# EAGLE design camera_module_dev (EAGLE 6.5.0)
AUTHOR: Austin Buchan; REVISION: 0.1
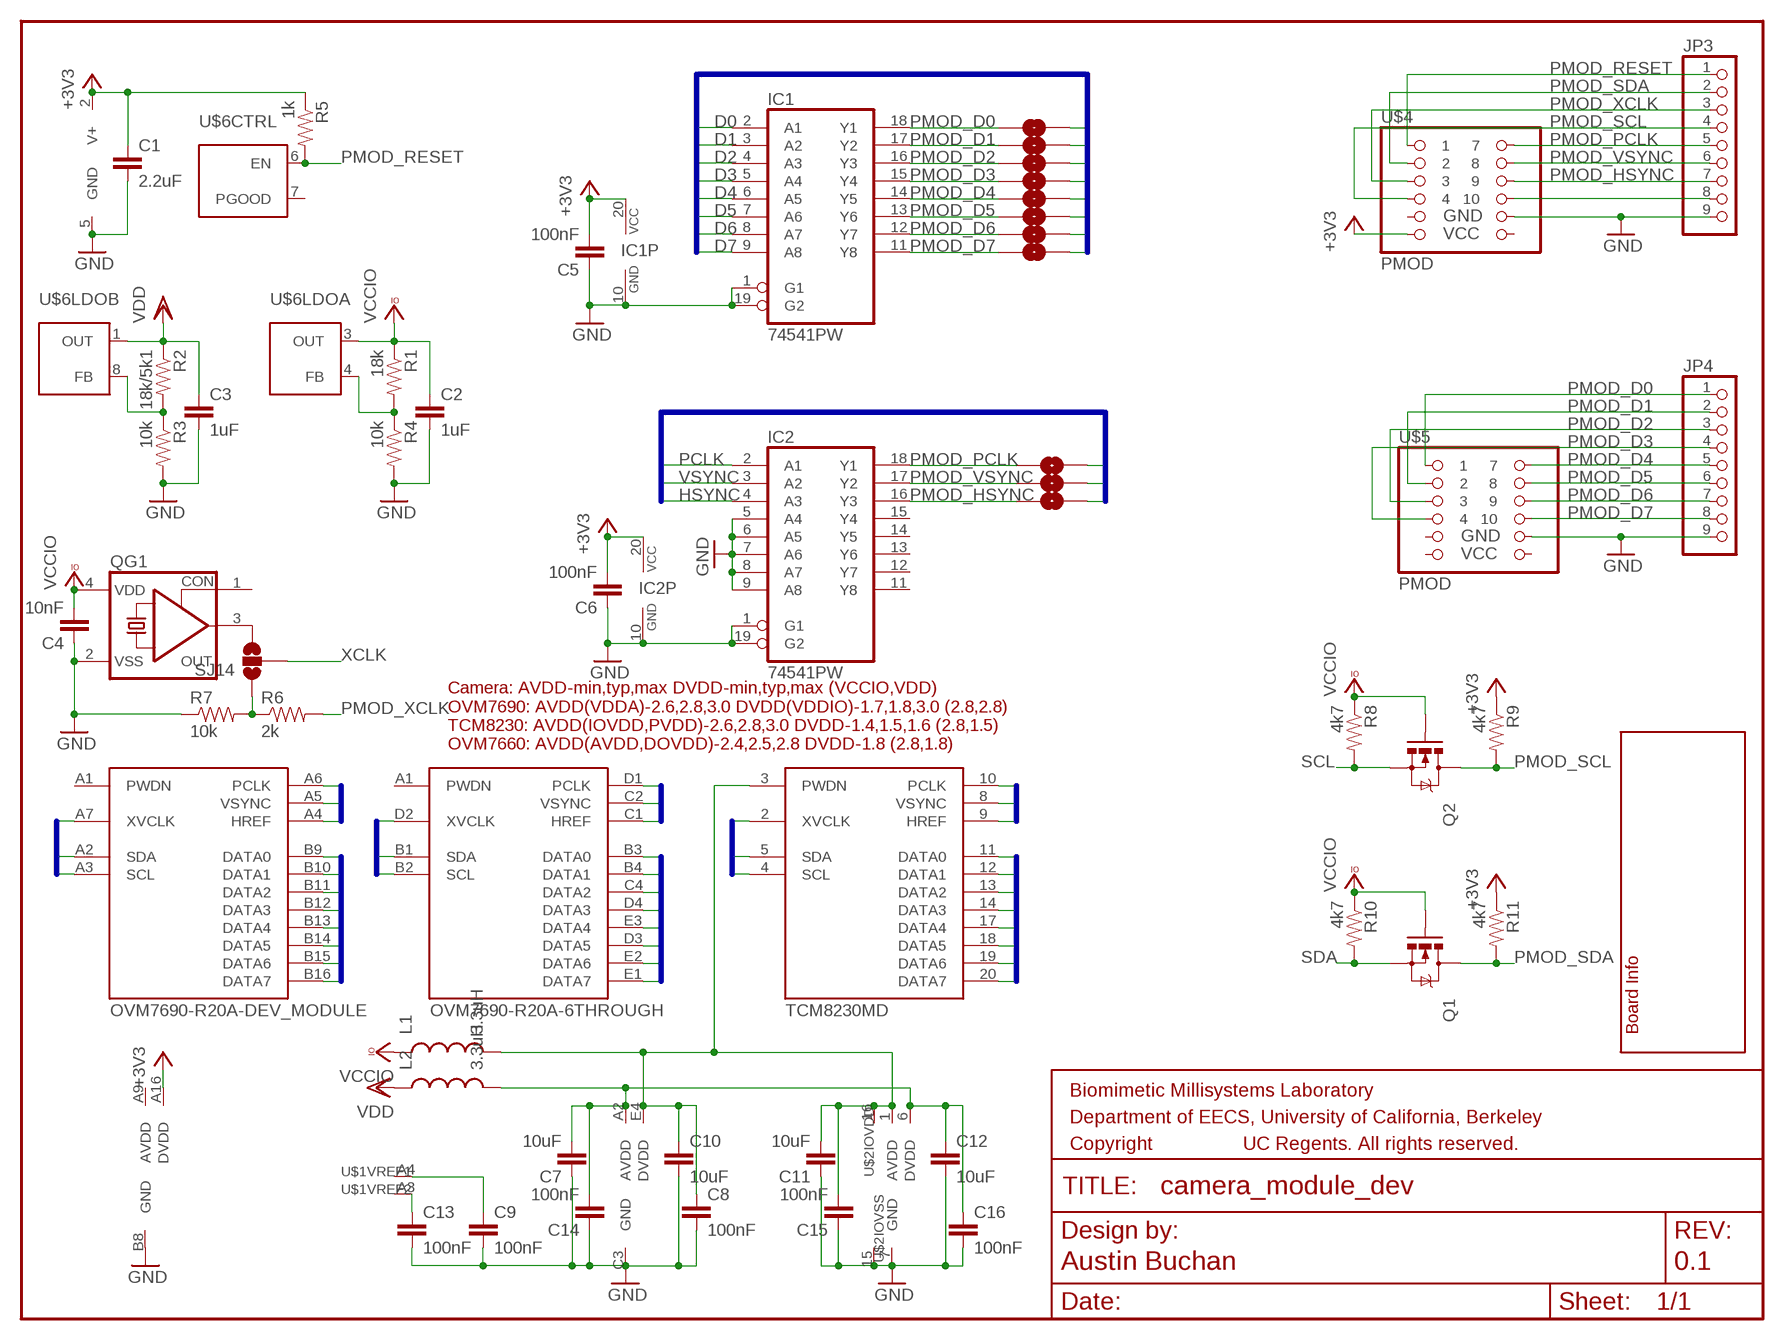
[diagram p0: schematic, sheet 1]

## Parts
C1  2.2uF  CAP0402-CAP  [0402-CAP]
C2  1uF  CAP0402-CAP  [0402-CAP]
C3  1uF  CAP0402-CAP  [0402-CAP]
C4  10nF  CAP0402-CAP  [0402-CAP]
C5  100nF  CAP0402-CAP  [0402-CAP]
C6  100nF  CAP0402-CAP  [0402-CAP]
C7  10uF  CAP0603-CAP  [0603-CAP]
C8  100nF  CAP0402-CAP  [0402-CAP]
C9  100nF  CAP0402-CAP  [0402-CAP]
C10  10uF  CAP0603-CAP  [0603-CAP]
C11  10uF  CAP0603-CAP  [0603-CAP]
C12  10uF  CAP0603-CAP  [0603-CAP]
C13  100nF  CAP0402-CAP  [0402-CAP]
C14  100nF  CAP0402-CAP  [0402-CAP]
C15  100nF  CAP0402-CAP  [0402-CAP]
C16  100nF  CAP0402-CAP  [0402-CAP]
IC1  74541PW  [TSSOP20]
IC2  74541PW  [TSSOP20]
JP3  PINHD-1X9  [1X09]
JP4  PINHD-1X9  [1X09]
L1  3.3uH  INDUCTOR1007  [1007]
L2  3.3uH  INDUCTOR1007  [1007]
Q1  MOSFET-NCHANNELBSS123LT1G  [SOT23]
Q2  MOSFET-NCHANNELBSS123LT1G  [SOT23]
QG1  CRYSTAL_RES--SMD-4  [SMD-4]
R1  18k  RESISTOR0402-RES  [0402-RES]
R2  18k/5k1  RESISTOR0402-RES  [0402-RES]
R3  10k  RESISTOR0402-RES  [0402-RES]
R4  10k  RESISTOR0402-RES  [0402-RES]
R5  1k  RESISTOR0402-RES  [0402-RES]
R6  2k  RESISTOR0402-RES  [0402-RES]
R7  10k  RESISTOR0402-RES  [0402-RES]
R8  4k7  RESISTOR0402-RES  [0402-RES]
R9  4k7  RESISTOR0402-RES  [0402-RES]
R10  4k7  RESISTOR0402-RES  [0402-RES]
R11  4k7  RESISTOR0402-RES  [0402-RES]
SJ1  SOLDERJUMPERNO  [SJ_2S-NO]
SJ2  SOLDERJUMPERNO  [SJ_2S-NO]
SJ3  SOLDERJUMPERNO  [SJ_2S-NO]
SJ4  SOLDERJUMPERNO  [SJ_2S-NO]
SJ5  SOLDERJUMPERNO  [SJ_2S-NO]
SJ6  SOLDERJUMPERNO  [SJ_2S-NO]
SJ7  SOLDERJUMPERNO  [SJ_2S-NO]
SJ8  SOLDERJUMPERNO  [SJ_2S-NO]
SJ9  SOLDERJUMPERNO  [SJ_2S-NO]
SJ10  SOLDERJUMPERNO  [SJ_2S-NO]
SJ11  SOLDERJUMPERNO  [SJ_2S-NO]
SJ14  SOLDERJUMPER_2WAYS  [SJ_3]
U$1  OVM7690-R20A-6THROUGH  [CSP3-20-6THROUGH]
U$2  TCM8230MD  [TCM-20]
U$3  OVM7690-R20A-DEV_MODULE  [OVM_DEV_MODULE]
U$4  PMOD  [2X06]
U$5  PMOD  [2X06]
U$6  SC560C  [MLPQ-UT8]
U$7  INFO  [INFO]

## Nets
+3V3: C1.1 C5.2 C6.2 IC1.20(VCC) IC2.20(VCC) R5.1 R9.1 R11.1 U$3.A16(DVDD) U$4.11 U$6.2(V+)
D0: IC1.2(A1) SJ1.2 U$1.B3(DATA0) U$2.11(DATA0) U$3.B9(DATA0)
D1: IC1.3(A2) SJ2.2 U$1.B4(DATA1) U$2.12(DATA1) U$3.B10(DATA1)
D2: IC1.4(A3) SJ3.2 U$1.C4(DATA2) U$2.13(DATA2) U$3.B11(DATA2)
D3: IC1.5(A4) SJ4.2 U$1.D4(DATA3) U$2.14(DATA3) U$3.B12(DATA3)
D4: IC1.6(A5) SJ5.2 U$1.E3(DATA4) U$2.17(DATA4) U$3.B13(DATA4)
D5: IC1.7(A6) SJ6.2 U$1.D3(DATA5) U$2.18(DATA5) U$3.B14(DATA5)
D6: IC1.8(A7) SJ7.2 U$1.E2(DATA6) U$2.19(DATA6) U$3.B15(DATA6)
D7: IC1.9(A8) SJ8.2 U$1.E1(DATA7) U$2.20(DATA7) U$3.B16(DATA7)
GND: C1.2 C2.2 C3.2 C4.1 C5.1 C6.1 C7.1 C8.2 C9.2 C10.2 C11.1 C12.2 C13.2 C14.1 C15.1 C16.2 IC1.1(G1) IC1.10(GND) IC1.19(G2) IC2.1(G1) IC2.5(A4) IC2.6(A5) IC2.7(A6) IC2.8(A7) IC2.9(A8) IC2.10(GND) IC2.19(G2) JP3.9 JP4.9 QG1.2(VSS) R3.2 R4.2 R7.1 U$1.C3(GND) U$2.7(GND) U$2.15(IOVSS:V) U$3.B8(GND) U$4.10 U$5.10 U$6.5(GND)
HSYNC: IC2.4(A3) SJ11.2 U$1.C1(HREF) U$2.9(HREF) U$3.A4(HREF)
N$1: QG1.3(OUT) SJ14.3
N$2: JP3.8 U$4.8
N$3: R6.1 R7.2 SJ14.1
N$4: C13.1 U$1.A3(VREF2:V)
N$5: C9.1 U$1.A4(VREF1:V)
N$6: C7.2 C12.1 C14.2 C16.1 L2.2 U$1.A2(AVDD) U$2.6(DVDD)
N$8: C8.1 C10.1 C11.2 C15.2 L1.2 U$1.E4(DVDD) U$2.1(AVDD) U$2.3(PWDN) U$2.16(IOVDD:V)
N$19: R1.2 R4.1 U$6.4(LDOA:FB)
N$21: R2.2 R3.1 U$6.8(LDOB:FB)
PCLK: IC2.2(A1) SJ9.2 U$1.D1(PCLK) U$2.10(PCLK) U$3.A6(PCLK)
PMOD_D0: IC1.18(Y1) JP4.1 SJ1.1 U$5.1
PMOD_D1: IC1.17(Y2) JP4.2 SJ2.1 U$5.3
PMOD_D2: IC1.16(Y3) JP4.3 SJ3.1 U$5.5
PMOD_D3: IC1.15(Y4) JP4.4 SJ4.1 U$5.7
PMOD_D4: IC1.14(Y5) JP4.5 SJ5.1 U$5.2
PMOD_D5: IC1.13(Y6) JP4.6 SJ6.1 U$5.4
PMOD_D6: IC1.12(Y7) JP4.7 SJ7.1 U$5.6
PMOD_D7: IC1.11(Y8) JP4.8 SJ8.1 U$5.8
PMOD_HSYNC: IC2.16(Y3) JP3.7 SJ11.1 U$4.6
PMOD_PCLK: IC2.18(Y1) JP3.5 SJ9.1 U$4.2
PMOD_RESET: JP3.1 R5.2 U$4.1 U$6.6(CTRL:EN)
PMOD_SCL: JP3.4 Q2.3(D) R9.2 U$4.7
PMOD_SDA: JP3.2 Q1.3(D) R11.2 U$4.3
PMOD_VSYNC: IC2.17(Y2) JP3.6 SJ10.1 U$4.4
PMOD_XCLK: JP3.3 R6.2 U$4.5
SCL: Q2.2(S) R8.2 U$1.B2(SCL) U$2.4(SCL) U$3.A3(SCL)
SDA: Q1.2(S) R10.2 U$1.B1(SDA) U$2.5(SDA) U$3.A2(SDA)
VCCIO: C2.1 C4.2 L1.1 Q1.1(G) Q2.1(G) QG1.4(VDD) R1.1 R8.1 R10.1 U$6.3(LDOA:OUT)
VDD: C3.1 L2.1 R2.1 U$6.1(LDOB:OUT)
VSYNC: IC2.3(A2) SJ10.2 U$1.C2(VSYNC) U$2.8(VSYNC) U$3.A5(VSYNC)
XCLK: SJ14.2 U$1.D2(XVCLK) U$2.2(XVCLK) U$3.A7(XVCLK)
Unconnected: IC2.11(Y8) IC2.12(Y7) IC2.13(Y6) IC2.14(Y5) IC2.15(Y4) QG1.1(CON) U$1.A1(PWDN) U$3.A1(PWDN) U$4.9 U$4.12 U$5.9 U$5.11 U$5.12 U$6.7(CTRL:PGOOD)

## Buses
D[0..7]
PCLK,VSYNC,HSYNC
PMOD_RESET,XCLK,SDA,SCL

## Notes on the sheet
- Camera: AVDD-min,typ,max DVDD-min,typ,max (VCCIO,VDD)
  OVM7690: AVDD(VDDA)-2.6,2.8,3.0 DVDD(VDDIO)-1.7,1.8,3.0 (2.8,2.8)
  TCM8230: AVDD(IOVDD,PVDD)-2.6,2.8,3.0 DVDD-1.4,1.5,1.6 (2.8,1.5)
  OVM7660: AVDD(AVDD,DOVDD)-2.4,2.5,2.8 DVDD-1.8 (2.8,1.8)

## Power pins joined to a net without a drawn wire
AVDD: U$3.A9(AVDD)
V: U$3.A10(VREF1:V) U$3.A11(VREF2:V)

## Library data of the parts
C1-C16 = biomimetic:CAP: Capacitor Standard 0603 ceramic capacitor, and 0.1" leaded capacitor.; VOLTAGE: 6.3V
IC1 IC2 = modular_robotics:74*541: Octal BUFFER and LINE DRIVER, 3-state
JP3 JP4 = pinhead:PINHD-1X9: PIN HEADER
L1 L2 = biomimetic:INDUCTOR: Inductors Basic Inductor/Choke - 0603 and 1206. Footprints are not proven and vary greatly between part numbers.
Q1 Q2 = SparkFun-DiscreteSemi:MOSFET-NCHANNEL: Common NMOSFET Parts MFG P/N Store ID Prod ID FDD8780 TRANS-09984 SI7820DN TRANS-11055 FDS6630A IC-08089 2N7002PW TRANS-11151 FQP30N06L COM-10213 TRANS-10060 BSS123LT1G TRANS-08345 BSS138 TRANS-00830 BS170 2N7000; PROD_ID: TRANS-08345
QG1 = modular_robotics:CRYSTAL_RES-: CRYSTAL RESONATOR
R1-R11 = biomimetic:RESISTOR: Resistor Basic schematic elements and footprints for 0603, 1206, and PTH resistors.
SJ1-SJ11 = SparkFun-Passives:SOLDERJUMPER: Solder Jumper Standard SMD solder jumper. Used to automate production. Two varients : Normally Open and Normally Closed are the same, but have different paste layers. NC will have a large amount of paste and should jumper during reflow.
SJ14 = SparkFun-Passives:SOLDERJUMPER_2WAY: Solder Jumper 2 way solder jumper
U$1 U$3 = modular_robotics:OVM7690-R20A
U$2 = modular_robotics:TCM8230MD
U$4 U$5 = modular_robotics:PMOD
U$6 = modular_robotics:SC560C
U$7 = modular_robotics:INFO; AUTHOR: Austin Buchan; DATE: Feb. 2014; DESIGN: Dev Camera Module; ORGANIZATION: UC Berkeley Biomimetic Millisystems Lab; REVISION: r0.1

## Board
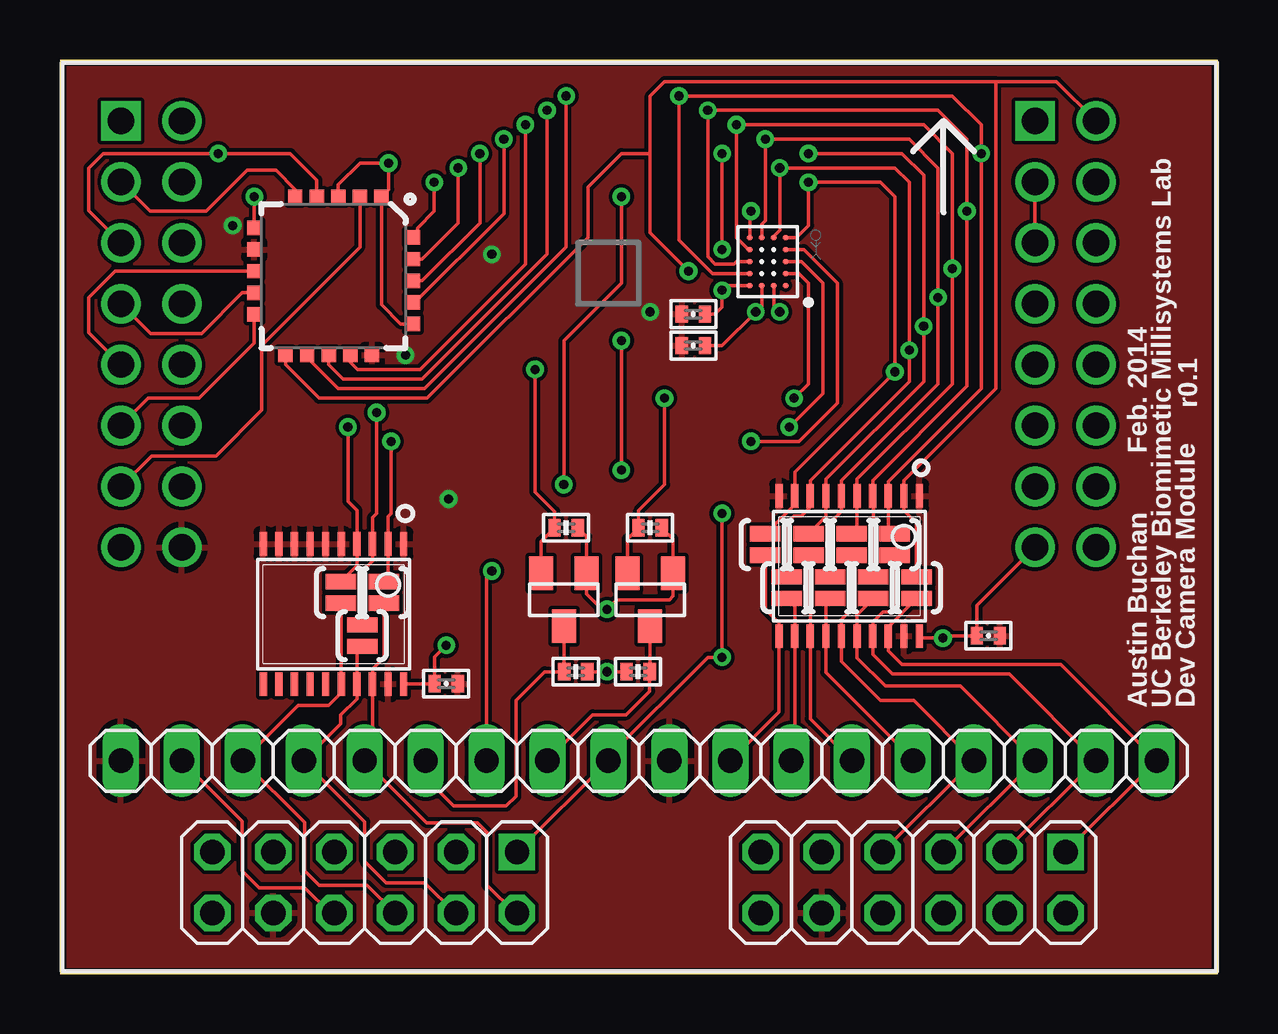
[diagram p1: board, top side]
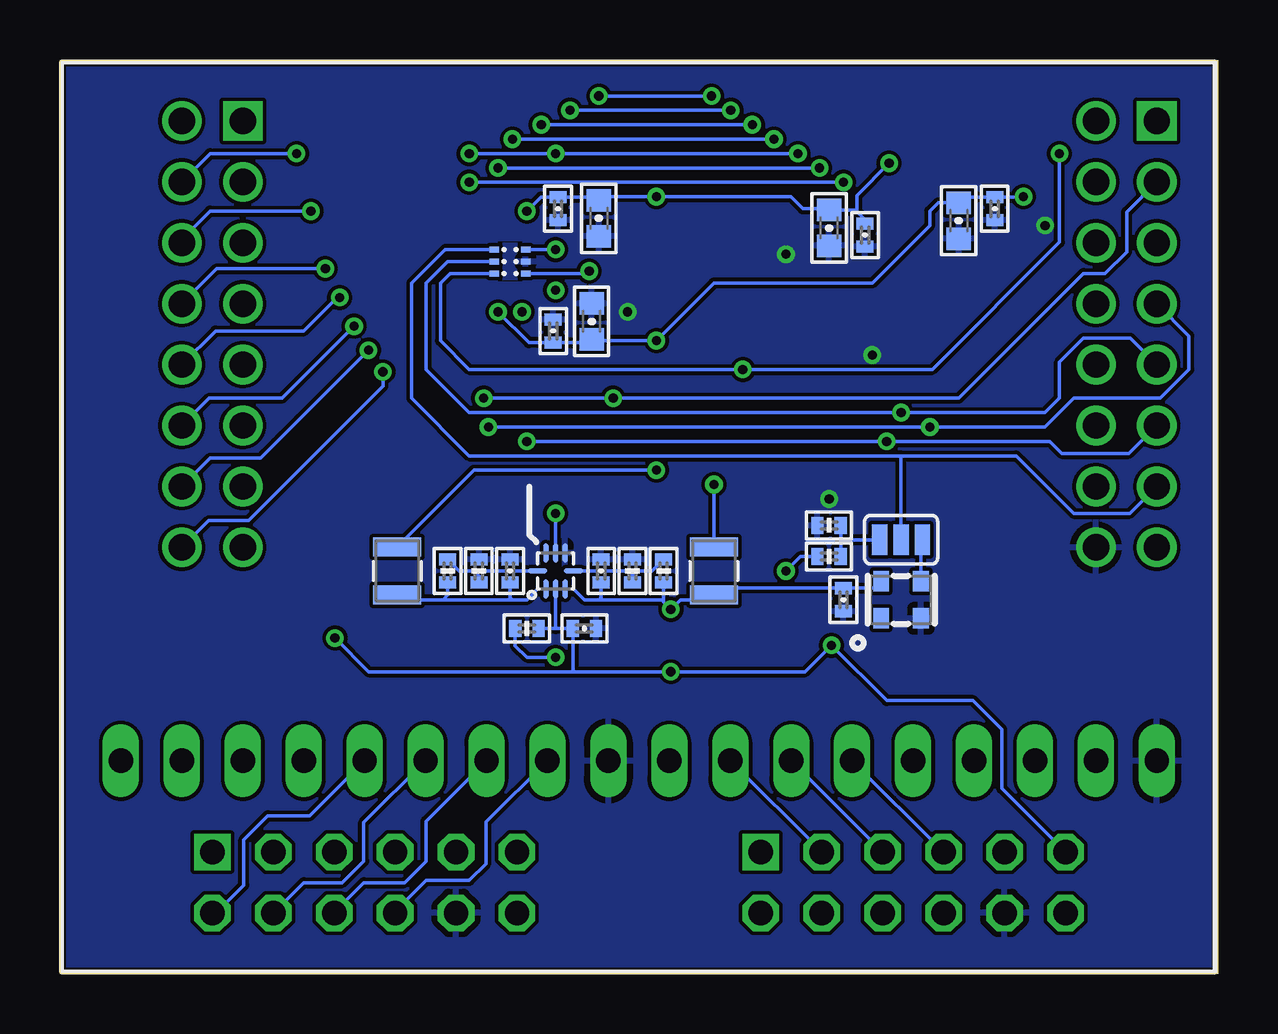
[diagram p2: board, bottom side, seen from below]

Size 48.26 x 38.1 mm. Coordinates in mm from the lower left corner, seen from the top.
Outline: 0,0 48.26,0 48.26,38.1 0,38.1 0,0
Copper layers (1*2+3*16): Top 2mil / dielectric 9mil / Route2 2mil / dielectric 40mil / Route3 2mil / dielectric 9mil / Bottom 2mil
Design rules "advancedcircuits-66each-biomimetic": minimum track width 6mil, minimum drill 15mil, track to track 6mil, track to pad 6mil, pad to pad 6mil, via to via 6mil, smd to smd 6mil, copper to edge 10mil, drill to drill 7mil, minimum pad ring 7mil, minimum via ring 7mil, stop-mask expansion 3mil, vias tented up to drill 0mil, thermal gap 10mil

### Footprints (pad centres in the part's own frame; a part is rotated, then mirrored left to right if it is on the bottom)
0402-CAP = smd 0.508 x 0.711: 1 -0.483,0; 2 0.483,0
0603-CAP = smd 0.94 x 1.016: 1 -0.749,0; 2 0.749,0
TSSOP20 = smd 0.305 x 0.991: 1 -2.925,-2.918; 2 -2.275,-2.918; 3 -1.625,-2.918; 4 -0.975,-2.918; 5 -0.325,-2.918; 6 0.325,-2.918; 7 0.975,-2.918; 8 1.625,-2.918; 9 2.275,-2.918; 10 2.925,-2.918; 11 2.925,2.918; 12 2.275,2.918; 13 1.625,2.918; 14 0.975,2.918; 15 0.325,2.918; 16 -0.325,2.918; 17 -0.975,2.918; 18 -1.625,2.918; 19 -2.275,2.918; 20 -2.925,2.918
1X09 = drill 1.016 long: 1 -10.16,0; 2 -7.62,0; 3 -5.08,0; 4 -2.54,0; 5 0,0; 6 2.54,0; 7 5.08,0; 8 7.62,0; 9 10.16,0
1007 = smd 2 x 0.8: 1 0,1; 2 0,-1
SOT23 = smd 1 x 1.4: 1 -0.95,-1.1; 2 0.95,-1.1; 3 0,1.1
SMD-4 = smd 0.65 x 0.85: 1 -0.825,-0.775; 2 0.825,-0.775; 3 0.825,0.775; 4 -0.825,0.775
0402-RES = smd 0.508 x 0.711: 1 -0.483,0; 2 0.483,0
SJ_2S-NO = smd 0.635 x 1.27: 1 -0.45,0; 2 0.45,0
SJ_3 = smd 0.635 x 1.27: 1 -0.889,0; 2 0,0; 3 0.889,0
CSP3-20-6THROUGH = smd 0.23 x 0.23: A1 -0.75,1; A2 -0.25,1; A3 0.25,1; A4 0.75,1; B1 -0.75,0.5; B4 0.75,0.5; C1 -0.75,0; C4 0.75,0; D1 -0.75,-0.5; D4 0.75,-0.5; E1 -0.75,-1; E2 -0.25,-1; E3 0.25,-1; E4 0.75,-1 | smd 0.4 x 0.25 bottom: B2 -0.649,0.502; B3 0.65,0.502; C2 -0.649,0.003; C3 0.65,0.003; D2 -0.649,-0.497; D3 0.65,-0.497
TCM-20 = smd 0.6 x 0.6: 1 2,3.3; 2 1.1,3.3; 3 0.2,3.3; 4 -0.7,3.3; 5 -1.6,3.3; 6 -3.3,2; 7 -3.3,1.1; 8 -3.3,0.2; 9 -3.3,-0.7; 10 -3.3,-1.6; 11 -2,-3.3; 12 -1.1,-3.3; 13 -0.2,-3.3; 14 0.7,-3.3; 15 1.6,-3.3; 16 3.3,-2; 17 3.3,-1.1; 18 3.3,-0.2; 19 3.3,0.7; 20 3.3,1.6
OVM_DEV_MODULE = drill 1.1 square: A1 0,17.78; A9 38.1,17.78 | drill 1.1: A2 0,15.24; A3 0,12.7; A4 0,10.16; A5 0,7.62; A6 0,5.08; A7 0,2.54; A8 0,0; A10 38.1,15.24; A11 38.1,12.7; A12 38.1,10.16; A13 38.1,7.62; A14 38.1,5.08; A15 38.1,2.54; A16 38.1,0; B1 2.54,17.78; B2 2.54,15.24; B3 2.54,12.7; B4 2.54,10.16; B5 2.54,7.62; B6 2.54,5.08; B7 2.54,2.54; B8 2.54,0; B9 40.64,17.78; B10 40.64,15.24; B11 40.64,12.7; B12 40.64,10.16; B13 40.64,7.62; B14 40.64,5.08; B15 40.64,2.54; B16 40.64,0
2X06 = drill 1.016 square: 1 -6.35,-1.27 | drill 1.016 octagon: 2 -6.35,1.27; 3 -3.81,-1.27; 4 -3.81,1.27; 5 -1.27,-1.27; 6 -1.27,1.27; 7 1.27,-1.27; 8 1.27,1.27; 9 3.81,-1.27; 10 3.81,1.27; 11 6.35,-1.27; 12 6.35,1.27
MLPQ-UT8 = smd 0.8 x 0.2: 1 -0.75,0.4; 2 -0.75,0; 3 -0.75,-0.4; 5 0.75,-0.4; 6 0.75,0; 7 0.75,0.4 | smd 0.2 x 0.8: 4 0,-0.75; 8 0,0.75

### Placement (x,y rotation side)
C1  26.4,14.4 0 bottom
C2  25.7,16.8 90 bottom
C3  29.5,16.8 90 bottom
C4  15.6,15.6 90 bottom
C5  38.7,14.1 180 top
C6  16.1,12.1 180 top
C7  26.1,27.2 270 bottom
C8  27.5,31.9 270 bottom
C9  26.4,27.5 180 top
C10  25.8,31.5 270 bottom
C11  16.2,31.1 90 bottom
C12  10.8,31.4 270 bottom
C13  26.4,26.2 180 top
C14  27.7,26.8 270 bottom
C15  14.7,30.8 90 bottom
C16  9.3,31.9 270 bottom
IC1  32.9,17 180 top
IC2  11.4,15 180 top
JP3  12.7,8.89 180 top
JP4  35.56,8.89 180 top
L1  21,16.8 180 bottom
L2  34.2,16.8 180 bottom
Q1  24.6,15.6 180 top
Q2  21,15.6 180 top
QG1  13.2,15.6 0 bottom
R1  23.1,16.8 90 bottom
R2  32.1,16.8 90 bottom
R3  30.8,16.8 90 bottom
R4  24.4,16.8 90 bottom
R5  28.8,14.4 180 bottom
R6  16.2,17.4 180 bottom
R7  16.2,18.7 0 bottom
R8  21.1,18.6 180 top
R9  21.5,12.6 180 top
R10  24.6,18.6 180 top
R11  24.1,12.6 0 top
SJ1  35.7,16.1 90 top
SJ2  34.8,17.9 90 top
SJ3  33.9,16.1 90 top
SJ4  33,17.9 90 top
SJ5  32.1,16.1 90 top
SJ6  31.2,17.9 90 top
SJ7  30.3,16.1 90 top
SJ8  29.4,17.9 90 top
SJ9  13.5,15.9 90 top
SJ10  12.6,14.1 90 top
SJ11  11.7,15.9 90 top
SJ14  13.2,18.1 0 bottom
U$1  29.5,29.7 180 top
U$2  11.4,29.1 0 top
U$3  2.54,17.78 0 top
U$4  12.7,3.81 180 top
U$5  35.56,3.81 180 top
U$6  27.6,16.8 90 bottom
U$7  49.3,11.1 90 top

### Tracks (layer width: path | path; a pad name or v marks a point on that pad's centre or on a via)
+3V3  (via drill 0.38)
  Top 0.152: R9.1 v22.8,12.6 R11.1 | IC2.20 15.6,12.08 C6.2 15.62,13.22 v16.1,13.7 | IC1.20 35.91,14 v36.8,14 36.9,14.1 C5.2 38.22,15.36 U$3.A16
  Bottom 0.152: 26.8,12.6 35.4,12.6 v36.8,14 | 26.8,12.6 v22.8,12.6 17.2,12.6 v16.1,13.7 13.8,11.4 10.2,11.4 9,10.2 9,7.73 U$4.11 | 27.6,14.4 C1.1 26.88,12.68 26.8,12.6 | 27.6,14.4 R5.1 | U$6.2 27.6,14.4
D0  (via drill 0.38)
  Top 0.152: SJ1.2 35.7,18.8 35.17,19.32 IC1.2 35.17,20.57 39,24.4 39,37.2 | 39,37.2 41.54,37.2 U$3.B9 | 39,37.2 25.2,37.2 24.6,36.6 24.6,34.2 | v26.2,29.3 24.6,30.9 24.6,34.2 | 24.6,34.2 23.4,34.2 22,32.8 22,30.7 15.3,24 10.8,24 9.4,25.4 U$2.11
  Bottom 0.152: U$1.B3 26.3,29.2 v26.2,29.3
D1  (via drill 0.38)
  Top 0.152: SJ2.2 34.52,18.62 IC1.3 34.52,20.52 38.4,24.4 v38.4,34.2 38.4,35.4 37.2,36.6 v25.8,36.6 25.8,30.6 27.2,29.2 U$1.B4 | v21.1,36.6 21.1,30.3 15.2,24.4 11.6,24.4 10.2,25.8 U$2.12
  Bottom 0.152: U$3.B10 42,34.2 v38.4,34.2 | v25.8,36.6 v21.1,36.6
D2  (via drill 0.38)
  Top 0.152: SJ3.2 33.9,19.89 IC1.4 33.88,20.57 37.8,24.5 v37.8,31.8 37.8,34.8 36.6,36 v27,36 27,29.9 27.3,29.6 28.1,29.6 28.2,29.7 U$1.C4 | v20.3,36 20.3,30 15.1,24.8 11.8,24.8 11.2,25.4 U$2.13
  Bottom 0.152: U$3.B11 43.18,30.62 42,31.8 v37.8,31.8 | v27,36 v20.3,36
D3  (via drill 0.38)
  Top 0.152: SJ4.2 33.23,18.57 IC1.5 33.23,20.62 37.2,24.6 v37.2,29.4 37.2,34.2 36,35.4 v28.2,35.4 28.2,30.7 28.7,30.2 U$1.D4 | v19.4,35.4 19.4,29.6 15,25.2 12.4,25.2 12.1,25.5 U$2.14
  Bottom 0.152: v28.2,35.4 v19.4,35.4 | U$3.B12 41.72,29.4 v37.2,29.4
D4  (via drill 0.38)
  Top 0.152: SJ5.2 32.1,18.8 32.58,19.27 IC1.6 32.58,20.57 36.6,24.6 v36.6,28.2 36.6,33.6 35.4,34.8 v29.4,34.8 29.4,31.4 29.25,31.25 U$1.E3 | v18.5,34.8 18.5,31.7 14.7,27.9 U$2.17
  Bottom 0.152: v29.4,34.8 v18.5,34.8 | U$3.B13 41.78,26.8 38.1,26.8 36.7,28.2 v36.6,28.2
D5  (via drill 0.38)
  Top 0.152: SJ6.2 31.93,19.07 IC1.7 31.93,20.62 36,24.7 v36,27 36,33.3 35.1,34.2 v31.2,34.2 | v27.6,30.2 v27.6,34.2 | v17.5,34.2 17.5,31.3 15.1,28.9 U$2.18
  Bottom 0.152: v31.2,34.2 v27.6,34.2 v17.5,34.2 | U$3.B14 42.04,24 39,24 v36,27 | U$1.D3 v27.6,30.2
D6  (via drill 0.38)
  Top 0.152: SJ7.2 30.3,18.8 30.6,19.1 30.9,19.1 31.27,19.48 IC1.8 | 31.27,19.57 IC1.8 | IC1.8 31.27,20.57 35.4,24.7 v35.4,26 35.4,33 34.8,33.6 v30,33.6 30,31 29.75,30.75 U$1.E2 | v16.6,33.6 16.6,31.3 15.1,29.8 U$2.19
  Bottom 0.152: v30,33.6 v16.6,33.6 | U$3.B15 42,21.5 39.9,21.5 v35.4,26
D7  (via drill 0.38)
  Top 0.152: SJ8.2 30.62,19.57 IC1.9 30.62,20.93 v34.8,25.1 34.8,32.4 34.2,33 v31.2,33 31.2,31.2 30.7,30.7 U$1.E1 | v15.6,33 15.6,31.8 14.9,31.1 14.9,30.9 U$2.20
  Bottom 0.152: v31.2,33 v15.6,33 | U$3.B16 42.06,18.9 40.4,18.9 34.8,24.5 v34.8,25.1
GND  (via drill 0.38)
  other vias: 18,30 14.4,25.8 24.6,27.6 16.2,19.8 7.2,31.2
  pour Top: 0,0 48.26,0 48.26,38.1 0,38.1
  pour Bottom: 0,0 48.26,0 48.26,38.1 0,38.1
HSYNC  (via drill 0.38)
  Top 0.152: SJ11.2 12.38,17.02 IC2.4 12.38,19.32 12,19.7 v12,22.8 | U$1.C1 30.9,29.7 31.8,28.8 31.8,24.2 v30.4,22.8 | U$3.A4 3.78,26.7 5.9,26.7 7.6,28.4 U$2.9
  Bottom 0.152: v30.4,22.8 v12,22.8 7.2,22.8 6,24 2.4,24 1.2,25.2 1.2,26.6 U$3.A4
N$1
  Bottom 0.152: QG1.3 12.38,18.04 SJ14.3
N$2
  Top 0.152: U$4.8 11.26,2.54 10.2,3.6 8.3,3.6 7.6,4.3 7.6,6.37 JP3.8
N$3
  Bottom 0.152: R6.1 15.72,18.1 | 15.72,18.1 R7.2 | SJ14.1 15.72,18.1
N$4  (via drill 0.38)
  Top 0.152: U$1.A3 29.25,27.85 v29,27.6 27.6,26.2 C13.1
N$5  (via drill 0.38)
  Top 0.152: U$1.A4 27.8,28.7 v27.6,28.5 27.6,27.8 27.3,27.5 C9.1
N$6  (via drill 0.38)
  Top 0.152: v23.4,21 v23.4,26.4 | v8.1,32.4 U$2.6 | U$1.A2 29.75,27.85 v30,27.6
  Bottom 0.152: L2.2 31,21 v23.4,21 | v8.1,32.4 8.12,32.38 C16.1 10.57,32.38 C12.1 11.65,32.15 12,31.8 12,31.2 14.4,28.8 21,28.8 v23.4,26.4 26.05,26.4 C7.2 26.23,26.32 C14.2 28.72,26.32 v30,27.6
N$8  (via drill 0.38)
  Top 0.152: U$1.E4 28.75,31.75 v28.8,31.8 | v21,20.4 21,26.4 23.4,28.8 v23.4,32.4 | U$2.16 14.2,27.1 13.4,27.9 U$2.1 13.7,32.7 v13.7,33.8 12.5,33.8 11.6,32.9 U$2.3
  Bottom 0.152: v28.8,31.8 28.22,32.38 C8.1 25.93,32.38 C10.1 25.65,32.4 v23.4,32.4 17.8,32.4 17.3,31.9 16.25,31.9 C11.2 15.1,31.85 | L1.2 v21,20.4 | 15.1,31.85 15.05,31.85 15.05,32.45 v13.7,33.8 | C15.2 14.7,31.45 15.1,31.85
N$19
  Bottom 0.152: U$6.4 24.4,16.8 | 24.4,16.8 23.58,16.8 R1.2 | R4.1 24.4,16.8
N$21
  Bottom 0.152: U$6.8 31,16.8 | 31,16.8 31.62,16.8 R2.2 | R3.1 30.8,16.6 31,16.8
PCLK  (via drill 0.38)
  Top 0.152: SJ9.2 13.68,16.52 IC2.2 13.68,19.07 13.8,19.2 v13.8,22.2 | U$1.D1 31,30.2 32.4,28.8 32.4,23.8 30.8,22.2 v28.8,22.2 | U$2.10 8.1,26.3 5.8,24 3.68,24 U$3.A6
  Bottom 0.152: v28.8,22.2 v13.8,22.2 7,22.2 6.5,21.7 3.7,21.7 U$3.A6
PMOD_D0
  Top 0.152: SJ1.1 34.52,14.47 IC1.18 34.52,13.47 35.1,12.9 41.71,12.9 JP4.1 U$5.1
PMOD_D1
  Top 0.152: SJ2.1 34.8,15.2 34.7,15.1 34.3,15.1 33.88,14.68 IC1.17 33.88,13.32 34.7,12.5 39.57,12.5 JP4.2 U$5.3
PMOD_D2
  Top 0.152: SJ3.1 33.23,14.97 IC1.16 33.23,13.18 34.4,12 37.53,12 JP4.3 U$5.5
PMOD_D3
  Top 0.152: SJ4.1 33,15.2 32.58,14.78 IC1.15 32.58,13.03 34.2,11.4 35.59,11.4 JP4.4 U$5.7
PMOD_D4
  Top 0.152: SJ5.1 31.93,15.47 IC1.14 31.93,12.57 35.56,8.94 JP4.5
  Bottom 0.152: U$5.2 41.76,2.54 40.6,3.7 40.6,5.6 39.6,6.6 37.85,6.6 JP4.5
PMOD_D5
  Top 0.152: SJ6.1 31.2,15.2 31.27,15.12 IC1.13 31.27,10.63 JP4.6
  Bottom 0.152: U$5.4 38.1,3.8 36.5,3.8 35.6,4.7 35.6,6.31 JP4.6
PMOD_D6
  Top 0.152: SJ7.1 30.62,15.32 IC1.12 30.62,9.04 JP4.7
  Bottom 0.152: U$5.6 36.83,2.57 35.6,3.8 33.9,3.8 33,4.7 33,6.37 JP4.7
PMOD_D7
  Top 0.152: SJ8.1 29.4,15.2 29.98,14.62 IC1.11 29.98,10.93 JP4.8
  Bottom 0.152: U$5.8 34.29,2.61 33,3.9 31.2,3.9 30.5,4.6 30.5,6.33 JP4.8
PMOD_HSYNC
  Top 0.152: U$4.6 12.8,3.7 10.8,3.7 10.2,4.3 10.2,6.31 JP3.7 9.93,11.2 11.2,11.2 11.72,11.72 IC2.16 11.72,15.43 SJ11.1
PMOD_PCLK
  Top 0.152: U$4.2 18.96,2.54 17.8,3.7 17.8,5.9 17.4,6.3 15.29,6.3 JP3.5 13.03,9.21 IC2.18 13.03,12.72 13.5,13.2 SJ9.1
PMOD_RESET  (via drill 0.38)
  Top 0.152: U$4.1 JP3.1 22.86,9.06 27,13.2 v27.6,13.2 v27.6,19.2
  Bottom 0.152: JP3.1 22.86,8.96 | R5.2 29.28,13.68 28.8,13.2 v27.6,13.2 | U$6.6 v27.6,19.2
PMOD_SCL
  Top 0.152: Q2.3 21,12.62 R9.2 20.2,12.6 19,11.4 19,7.4 18.6,7 16.4,7 15.24,8.16 JP3.4
  Bottom 0.152: U$4.7 JP3.4
PMOD_SDA
  Top 0.152: R11.2 24.6,12.6 | Q1.3 24.6,12.62 R11.2 | JP3.2 20.32,8.92 22.2,10.8 23.6,10.8 24.58,11.78 R11.2
  Bottom 0.152: U$4.3 JP3.2
PMOD_VSYNC
  Top 0.152: U$4.4 16.46,2.54 15.2,3.8 13.6,3.8 12.7,4.7 12.7,6.35 JP3.6 | 10.57,9.3 JP3.6 | SJ10.1 12.38,13.43 IC2.17 12.38,11.47 11.7,10.8 11.7,10.43 JP3.6
PMOD_XCLK  (via drill 0.38)
  Top 0.152: JP3.3 17.78,16.58 v18,16.8
  Bottom 0.152: U$4.5 JP3.3 | v18,16.8 17.4,17.4 R6.2
SCL  (via drill 0.38)
  Top 0.152: Q2.2 20.05,18.03 R8.2 20.62,19.28 19.8,20.1 v19.8,25.2 | U$3.A3 1.2,31.82 1.2,33.6 1.8,34.2 v6.6,34.2 9.6,34.2 10.7,33.1 U$2.4
  Bottom 0.152: U$1.B2 32,29.2 32.4,28.8 32.4,26.4 31.2,25.2 v19.8,25.2 11.9,25.2 6.6,30.5 v6.6,34.2
SDA  (via drill 0.38)
  Top 0.152: Q1.2 23.65,18.13 R10.2 24.12,19.32 25.2,20.4 v25.2,24 | U$1.B1 30.8,29.2 31.2,28.8 31.2,24.6 v30.6,24 | U$3.A2 3.76,31.8 6.1,31.8 7.8,33.5 9,33.5 9.8,32.7 U$2.5
  Bottom 0.152: v30.6,24 v25.2,24 10.8,24 5.6,29.2 4.7,29.2 3.8,30.1 3.8,31.76 U$3.A2
V
  Top 0.152: U$3.A10 U$3.A11
VCCIO  (via drill 0.38)
  Top 0.152: R10.1 25.55,18.13 Q1.1 25.55,15.75 25.4,15.6 23.2,15.6 v22.8,15.2 22.6,15.2 21.95,15.85 Q2.1 21.95,18.23 R8.1
  Bottom 0.152: QG1.4 14.32,16.08 C4.2 20.72,16.08 L1.1 21.2,15.6 22.4,15.6 v22.8,15.2 23.1,15.5 23.1,15.6 | U$6.3 26.85,16.05 26.4,15.6 25.8,15.6 | 25.8,15.6 23.1,15.6 | C2.1 25.7,15.7 25.8,15.6 | R1.1 23.1,15.6
VDD
  Bottom 0.152: U$6.1 28.35,16.05 28.8,15.6 29.4,15.6 | 29.4,15.6 32.3,15.6 | 32.3,15.6 34,15.6 L2.1 | C3.1 29.5,15.7 29.4,15.6 | R2.1 32.1,15.8 32.3,15.6
VSYNC  (via drill 0.38)
  Top 0.152: SJ10.2 12.6,16.8 13.03,17.23 IC2.3 13.03,19.02 13.2,19.2 v13.2,23.4 | U$2.8 2.3,29.3 1.2,28.2 1.2,26.74 U$3.A5
  Bottom 0.152: U$1.C2 32.1,29.7 33,28.8 33,25.2 31.2,23.4 v13.2,23.4 7.2,23.4 6.6,24 6.6,25.5 5.6,26.5 3.64,26.5 U$3.A5
XCLK
  Top 0.152: U$3.A7 3.82,21.6 6.5,21.6 8.4,23.5 8.4,26.2 12.5,30.3 U$2.2
  Bottom 0.152: U$1.D2 32.2,30.2 33.6,28.8 33.6,24 31.2,21.6 13.2,21.6 | 13.2,21.6 8.4,21.6 6,19.2 3.66,19.2 U$3.A7 | SJ14.2 13.2,21.6